# EAGLE design but8LED (EAGLE 7.2.0)
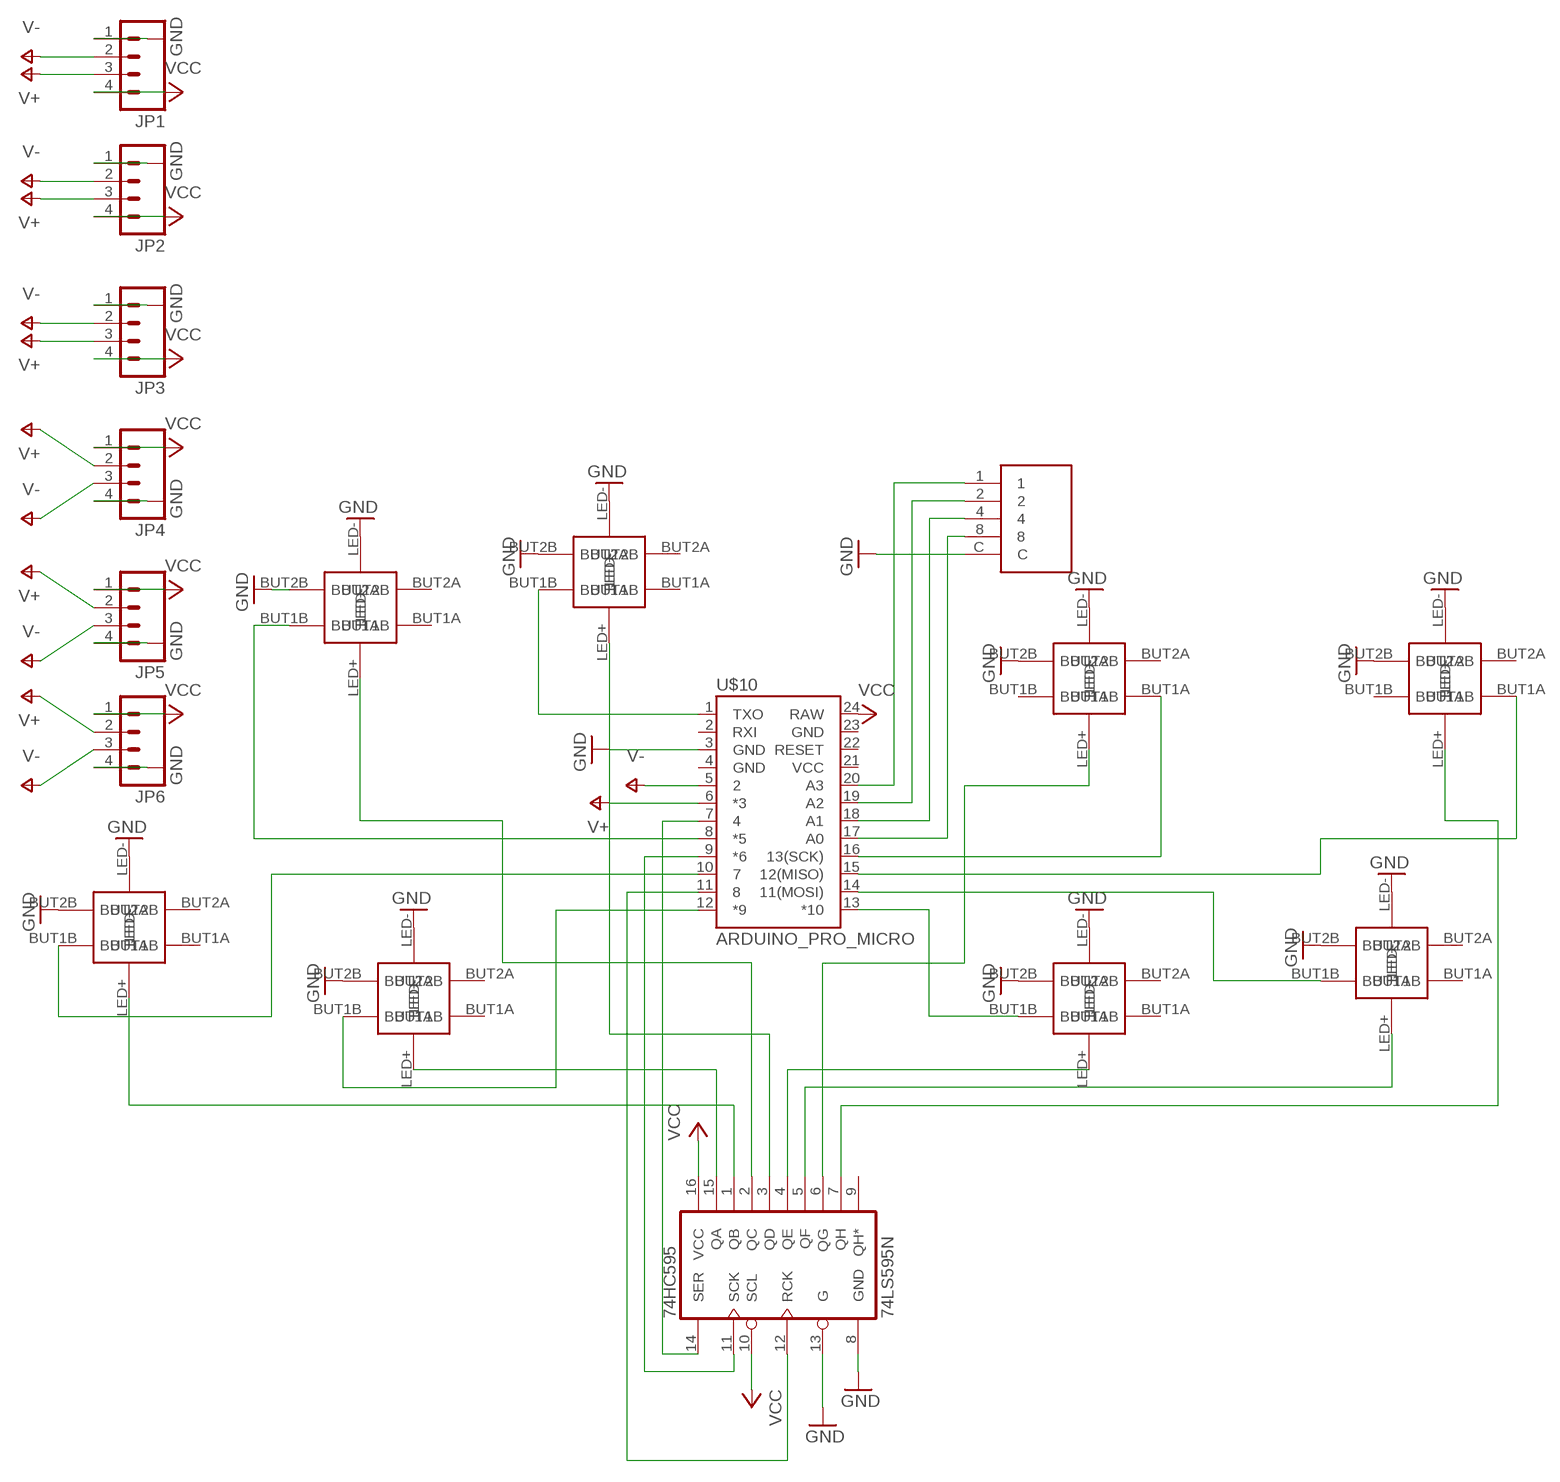
[diagram p0: schematic, sheet 1]

## Parts
74HC595  74LS595N  [DIL16]
JP1  M04PTH  [1X04]
JP2  M04PTH  [1X04]
JP3  M04PTH  [1X04]
JP4  M04PTH  [1X04]
JP5  M04PTH  [1X04]
JP6  M04PTH  [1X04]
U$1  BUTLED  [LEDBUT]
U$2  BUTLED  [LEDBUT]
U$3  BUTLED  [LEDBUT]
U$4  BUTLED  [LEDBUT]
U$5  BUTLED  [LEDBUT]
U$6  BUTLED  [LEDBUT]
U$7  BUTLED  [LEDBUT]
U$8  BUTLED  [LEDBUT]
U$9  SWITCH16POS  [SWITCH16POS]
U$10  ARDUINO_PRO_MICRO  [ARDUINO_PRO_MICRO]

## Nets
GND: 74HC595.8(GND) 74HC595.13(G) JP1.1 JP2.1 JP3.1 JP4.4 JP5.4 JP6.4 U$1.BUT2B U$1.LED- U$2.BUT2B U$2.LED- U$3.BUT2B U$3.LED- U$4.BUT2B U$4.LED- U$5.BUT2B U$5.LED- U$6.BUT2B U$6.LED- U$7.BUT2B U$7.LED- U$8.BUT2B U$8.LED- U$9.C U$10.3(GND)
N$1: U$9.1 U$10.20(A3)
N$2: U$9.2 U$10.19(A2)
N$3: U$1.BUT1B U$10.8(*5)
N$4: 74HC595.1(QB) U$6.LED+
N$5: U$6.BUT1B U$10.10
N$6: 74HC595.15(QA) U$5.LED+
N$7: 74HC595.2(QC) U$1.LED+
N$8: U$9.4 U$10.18(A1)
N$9: 74HC595.6(QG) U$3.LED+
N$10: 74HC595.7(QH) U$4.LED+
N$11: U$5.BUT1B U$10.12(*9)
N$12: U$9.8 U$10.17(A0)
N$13: 74HC595.3(QD) U$2.LED+
N$14: U$2.BUT1B U$10.1(TXO)
N$16: U$3.BUT1A U$10.16(13(SCK))
N$18: U$4.BUT1A U$10.15(12(MISO))
N$21: 74HC595.5(QF) U$8.LED+
N$22: U$8.BUT1B U$10.14(11(MOSI))
N$23: 74HC595.4(QE) U$7.LED+
N$24: U$7.BUT1B U$10.13(*10)
N$26: 74HC595.14(SER) U$10.7
N$27: 74HC595.11(SCK) U$10.9(*6)
N$28: 74HC595.12(RCK) U$10.11
V+: JP1.3 JP2.3 JP3.3 JP4.2 JP5.2 JP6.2 U$10.6(*3)
V-: JP1.2 JP2.2 JP3.2 JP4.3 JP5.3 JP6.3 U$10.5
VCC: 74HC595.10(SCL) 74HC595.16(VCC) JP1.4 JP2.4 JP3.4 JP4.1 JP5.1 JP6.1 U$10.24(RAW)
Unconnected: 74HC595.9(QH*) U$1.BUT1A U$1.BUT2A U$2.BUT1A U$2.BUT2A U$3.BUT1B U$3.BUT2A U$4.BUT1B U$4.BUT2A U$5.BUT1A U$5.BUT2A U$6.BUT1A U$6.BUT2A U$7.BUT1A U$7.BUT2A U$8.BUT1A U$8.BUT2A U$10.2(RXI) U$10.4(GND) U$10.21(VCC) U$10.22(RESET) U$10.23(GND)

## Library data of the parts
74HC595 = SparkFun-DigitalIC:74*595: 8-bit SHIFT REGISTER, output latch
JP1-JP6 = SparkFun-Connectors:M04: Header 4 Standard 4-pin 0.1" header. Use with straight break away headers (SKU : PRT-00116), right angle break away headers (PRT-00553), swiss pins (PRT-00743), machine pins (PRT-00117), and female headers (PRT-00115). Molex polarized connector foot print use with SKU : PRT-08231 with associated crimp pins and housings. 1MM SMD Version SKU: PRT-10208
U$1-U$8 = groovuino1:BUTLED
U$9 = groovuino1:SWITCH16POS
U$10 = SparkFun-Boards:ARDUINO_PRO_MICRO

## Board
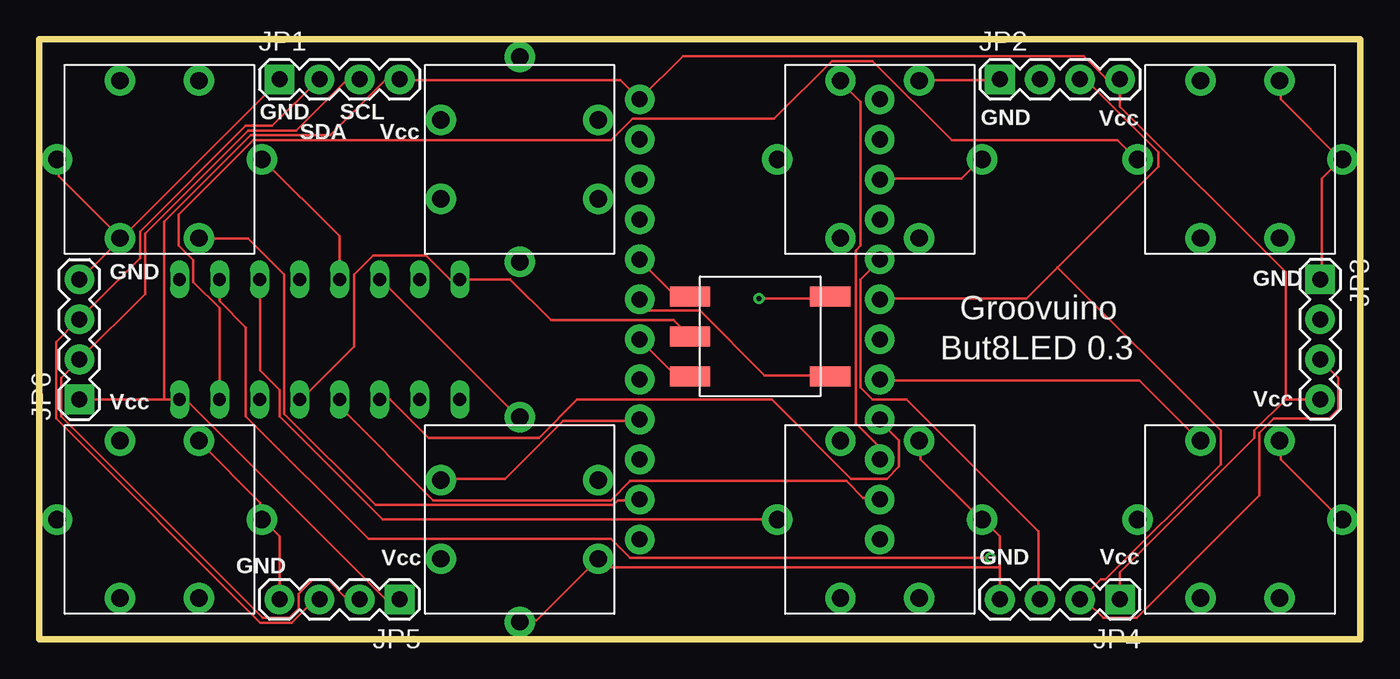
[diagram p1: board, top side]
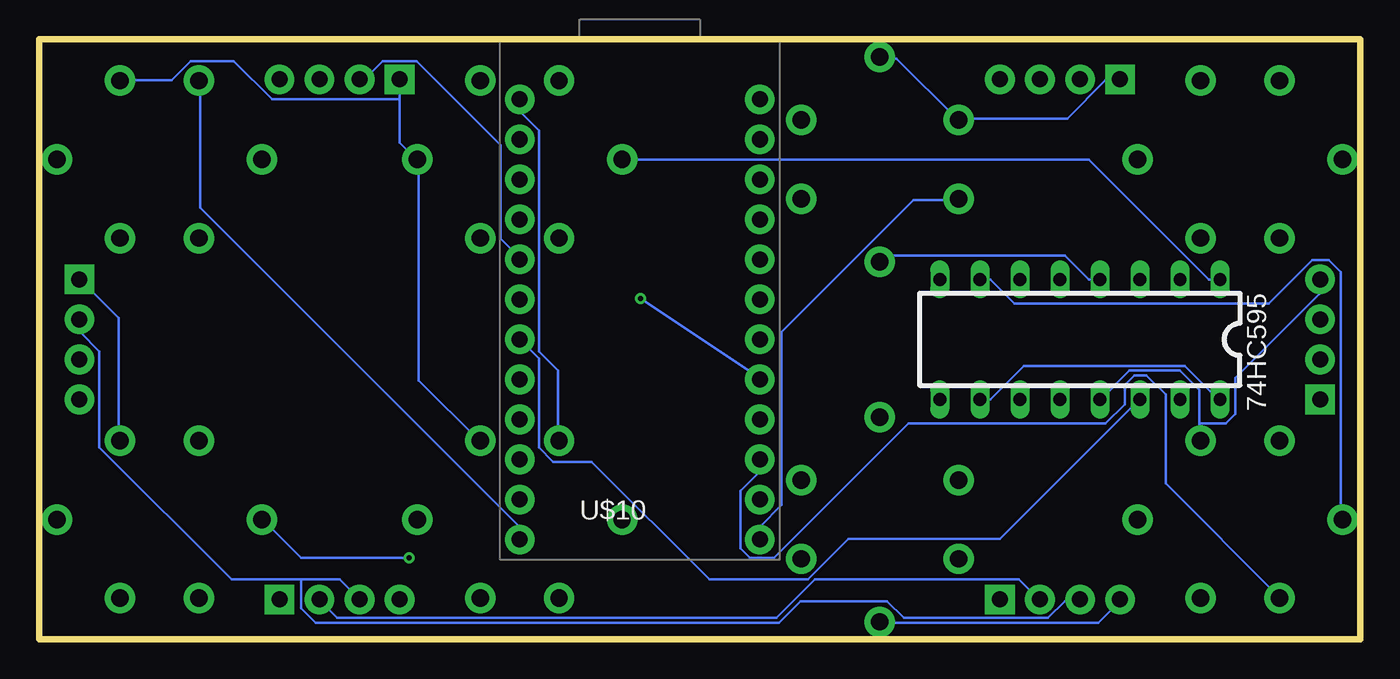
[diagram p2: board, bottom side, seen from below]

Size 83.82 x 38.1 mm. Coordinates in mm from the lower left corner, seen from the top.
Outline: 0,0 83.82,0 83.82,38.1 0,38.1 0,0
Copper layers (1*16): Top 0.0356mm / dielectric 1.5011mm / Bottom 0.0356mm
Design rules "LaenPCBOrder": minimum track width 6mil, minimum drill 13mil, track to track 6mil, track to pad 6mil, pad to pad 6mil, via to via 6mil, smd to smd 6mil, copper to edge 15mil, drill to drill 6mil, minimum pad ring 7mil, minimum via ring 7mil, stop-mask expansion 3mil, vias tented up to drill 0mil, thermal gap 10mil

### Footprints (pad centres in the part's own frame; a part is rotated, then mirrored left to right if it is on the bottom)
DIL16 = drill 0.813 long: 1 -8.89,-3.81; 2 -6.35,-3.81; 3 -3.81,-3.81; 4 -1.27,-3.81; 5 1.27,-3.81; 6 3.81,-3.81; 7 6.35,-3.81; 8 8.89,-3.81; 9 8.89,3.81; 10 6.35,3.81; 11 3.81,3.81; 12 1.27,3.81; 13 -1.27,3.81; 14 -3.81,3.81; 15 -6.35,3.81; 16 -8.89,3.81
1X04 = drill 1.016 pad 1.88 square: 1 0,0 | drill 1.016 pad 1.88: 2 2.54,0; 3 5.08,0; 4 7.62,0
LEDBUT = drill 1.1 pad 1.93: BUT1A -5,2.5; BUT1B 5,2.5; BUT2A -5,-2.5; BUT2B 5,-2.5; LED+ 0,6.5; LED- 0,-6.5
SWITCH16POS = smd 1.27 x 2.54: 1 5.08,8.89; 2 0,0; 4 0,8.89; 8 5.08,0; C 2.54,8.89
ARDUINO_PRO_MICRO = drill 1.016 pad 1.88: 1 -7.62,12.7; 2 -7.62,10.16; 3 -7.62,7.62; 4 -7.62,5.08; 5 -7.62,2.54; 6 -7.62,0; 7 -7.62,-2.54; 8 -7.62,-5.08; 9 -7.62,-7.62; 10 -7.62,-10.16; 11 -7.62,-12.7; 12 -7.62,-15.24; 13 7.62,-15.24; 14 7.62,-12.7; 15 7.62,-10.16; 16 7.62,-7.62; 17 7.62,-5.08; 18 7.62,-2.54; 19 7.62,0; 20 7.62,2.54; 21 7.62,5.08; 22 7.62,7.62; 23 7.62,10.16; 24 7.62,12.7

### Placement (x,y rotation side)
74HC595  17.78,19.05 180 bottom
JP1  15.24,35.56 0 top
JP2  60.96,35.56 0 top
JP3  81.28,22.86 270 top
JP4  68.58,2.54 180 top
JP5  22.86,2.54 180 top
JP6  2.54,15.24 90 top
U$1  76.2,7.62 90 top
U$2  53.34,7.62 90 top
U$3  30.48,7.62 0 top
U$4  7.62,7.62 90 top
U$5  76.2,30.48 90 top
U$6  53.34,30.48 90 top
U$7  30.48,30.48 180 top
U$8  7.62,30.48 270 top
U$9  50.19,16.7 90 top
U$10  45.72,21.59 0 bottom

### Tracks (layer width: path | path; a pad name or v marks a point on that pad's centre or on a via)
GND
  Top 0.152: U$1.BUT2B 78.79,12.5 78.79,11.43 82.6,7.62 U$1.LED- | 82.6,30.48 81.38,29.26 81.38,22.86 JP3.1 | 82.6,30.48 78.79,34.29 78.79,35.36 U$5.BUT2B | 82.6,30.48 U$5.LED- | JP2.1 60.96,35.51 55.93,35.51 U$6.BUT2B | U$10.3 53.34,29.26 58.52,29.26 59.74,30.48 U$6.LED- | 60.96,4.57 60.96,6.55 59.89,7.62 U$2.LED- 59.74,7.62 55.93,11.43 55.93,12.5 U$2.BUT2B | 60.96,4.57 JP4.4 | U$9.C 41.15,19.36 40.23,20.27 32.46,20.27 29.87,22.86 74HC595.8 26.06,22.86 24.54,24.38 21.18,24.38 19.96,23.17 19.96,18.59 16.61,15.24 74HC595.13 | 5.18,25.45 2.59,22.86 JP6.4 | U$8.LED- 1.22,30.48 1.22,29.41 5.03,25.6 U$8.BUT2B 5.18,25.45 | U$3.LED- 30.48,1.22 31.55,1.22 35.36,5.03 U$3.BUT2B 35.51,5.03 35.97,4.57 60.96,4.57 | JP5.4 15.24,6.55 14.17,7.62 U$4.LED- 14.02,7.62 14.02,8.69 10.21,12.5 U$4.BUT2B | 5.18,25.45 15.24,35.51 JP1.1
  Bottom 0.152: U$1.BUT2B 78.79,12.65 78.79,20.42 81.23,22.86 JP3.1 | 60.96,34.29 60.96,31.55 59.89,30.48 U$6.LED- 59.74,30.48 59.74,16.46 55.93,12.65 U$2.BUT2B | 60.96,34.29 JP2.1 | 60.96,34.29 69.04,34.29 71.48,36.73 74.22,36.73 75.44,35.51 78.64,35.51 U$5.BUT2B | JP1.1 15.24,35.51 16.15,35.51 18.59,33.07 25.45,33.07 U$7.BUT2B 25.6,33.07 29.41,36.88 30.48,36.88 U$7.LED- | 10.21,13.72 10.21,12.65 U$4.BUT2B | 10.21,13.72 10.21,15.85 11.43,17.07 14.63,17.07 16.46,15.24 74HC595.13 | U$3.LED- 30.48,1.07 16.61,1.07 15.24,2.44 JP5.4 | 10.21,13.72 8.53,13.72 7.92,14.33 7.92,16.61 2.59,21.95 2.59,22.86 JP6.4
N$1
  Top 0.152: U$9.1 41.15,21.79 40.39,21.79 38.1,24.08 U$10.20
N$2
  Top 0.152: U$9.2 50.14,16.76 46.02,16.76 41.91,20.88 38.71,20.88 38.1,21.49 U$10.19
N$3
  Top 0.152: U$10.8 53.34,16.46 69.8,16.46 73.61,12.65 U$1.BUT1B
N$4
  Bottom 0.152: 74HC595.1 9.6,22.86 17.22,30.48 U$6.LED+
N$5
  Top 0.152: U$10.10 53.34,12.19 51.82,13.72 51.82,24.69 52.12,24.99 52.12,34.14 50.9,35.36 U$6.BUT1B
N$6
  Top 0.152: 74HC595.15 11.43,21.03 9.75,22.71 9.75,24.08 8.84,24.99 8.84,26.98 13.56,31.7 36.27,31.7 37.64,33.07 46.63,33.07 50.29,36.73 52.88,36.73 57.91,31.7 68.43,31.7 69.65,30.48 U$5.LED+
N$7  (via drill 0.33)
  Top 0.152: 74HC595.2 11.43,21.49 13.11,19.81 13.11,14.17 20.88,6.4 36.27,6.4 37.49,5.18 v60.35,5.18
  Bottom 0.152: v60.35,5.18 67.21,5.18 69.65,7.62 U$1.LED+
N$8
  Top 0.152: U$10.18 40.39,16.76 41.15,16.76 U$9.4
N$9
  Top 0.152: 74HC595.6 21.64,22.86 30.48,14.02 U$3.LED+
N$10
  Bottom 0.152: 74HC595.7 23.47,22.86 21.95,21.34 5.79,21.34 3.05,24.08 1.98,24.08 1.22,23.32 1.22,7.62 U$4.LED+
N$11
  Bottom 0.152: U$10.12 53.34,7.16 73.61,27.43 73.61,35.36 U$5.BUT1B
N$12  (via drill 0.33)
  Top 0.152: v45.67,21.64 50.14,21.64 U$9.8
  Bottom 0.152: v45.67,21.64 38.1,16.61 U$10.17
N$13
  Top 0.152: U$2.LED+ 21.79,7.62 15.24,14.17 15.24,15.85 14.02,17.07 14.02,22.86 74HC595.3
N$14
  Bottom 0.152: U$10.1 53.34,33.53 52.12,32.31 52.12,18.29 50.9,17.07 50.9,12.65 U$2.BUT1B
N$16
  Top 0.152: U$10.16 38.1,13.87 33.22,13.87 29.57,10.21 25.6,10.21 U$3.BUT1A
N$18
  Bottom 0.152: U$10.15 38.1,10.67 39.32,9.45 39.32,5.79 38.71,5.18 37.19,5.18 28.65,13.72 16.15,13.72 14.94,14.94 14.94,16.15 14.33,16.76 13.56,16.76 12.34,15.54 12.34,9.91 5.18,2.74 U$4.BUT1A
N$21
  Top 0.152: 74HC595.5 19.05,25.6 14.17,30.48 U$8.LED+
N$22
  Top 0.152: U$10.14 38.1,8.84 36.73,8.84 36.42,8.53 21.34,8.53 15.54,14.33 15.54,23.17 13.26,25.45 10.21,25.45 U$8.BUT1B
N$23
  Bottom 0.152: 74HC595.4 17.22,22.86 18.75,24.38 30.18,24.38 30.48,24.08 U$7.LED+
N$24
  Bottom 0.152: U$10.13 38.1,7.16 36.73,8.53 36.73,19.51 28.35,27.89 25.6,27.89 U$7.BUT1B
N$26
  Bottom 0.152: U$10.7 52.12,17.83 52.12,12.19 51.21,11.28 48.77,11.28 41.3,3.81 35.05,3.81 32.46,6.4 22.86,6.4 14.02,15.24 74HC595.14
N$27
  Top 0.152: 74HC595.11 22.25,15.24 24.69,12.8 31.7,12.8 34.14,15.24 46.48,15.24 51.51,10.21 53.8,10.21 54.56,10.97 54.56,12.65 53.34,13.87 U$10.9
N$28
  Top 0.152: 74HC595.12 19.05,14.78 24.99,8.84 36.27,8.84 37.49,10.06 51.21,10.06 52.27,8.99 53.34,8.99 U$10.11
V+
  Top 0.152: JP5.2 20.27,2.59 19.51,2.59 18.29,3.81 17.37,3.81 16.46,2.9 16.46,1.98 15.85,1.37 14.17,1.37 1.37,14.17 1.37,16.61 JP6.2 6.71,21.95 6.71,25.76 13.26,32.31 16.31,32.31 19.51,35.51 20.27,35.51 JP1.3 | 64.62,23.62 71.02,30.02 71.02,30.94 66.45,35.51 66.14,35.51 JP2.3 | 64.62,23.62 62.64,21.64 53.34,21.64 U$10.6 | JP3.3 82.45,16.61 82.45,14.63 81.84,14.02 78.33,14.02 77.42,13.11 77.42,9.14 69.65,1.37 67.51,1.37 66.45,2.44 66.14,2.44 JP4.2 66.14,2.59 67.36,3.81 67.67,3.81 74.98,11.12 74.98,13.26 64.62,23.62
  Bottom 0.152: JP5.2 20.42,2.59 21.64,3.81 34.59,3.81 37.03,1.37 64.92,1.37 65.99,2.44 JP4.2
V-
  Top 0.152: JP5.3 17.68,2.44 17.37,2.44 16,1.07 14.02,1.07 1.07,14.02 1.07,18.9 2.44,20.27 JP6.3 2.59,20.42 6.4,24.23 6.4,25.91 13.11,32.61 14.78,32.61 17.68,35.51 JP1.2 | JP4.3 63.4,2.59 63.4,6.86 55.02,15.24 52.88,15.24 52.12,16 52.12,22.86 53.34,24.08 U$10.5
  Bottom 0.152: JP2.2 63.4,35.66 63.09,35.66 62.03,36.73 59.89,36.73 54.56,31.39 54.56,25.45 53.34,24.23 U$10.5 | 67.21,3.81 64.77,3.81 JP4.3 | 67.21,3.81 71.63,3.81 80.01,12.19 80.01,18.29 81.23,19.51 81.23,20.27 JP3.2 | 67.21,3.81 67.21,1.98 66.29,1.07 36.88,1.07 35.51,2.44 30.02,2.44 28.96,1.37 19.81,1.37 18.75,2.44 17.83,2.44 JP5.3
VCC
  Top 0.152: JP4.1 68.58,4.27 77.11,12.8 77.11,13.26 79.1,15.24 | JP3.4 79.1,15.24 | 79.1,15.24 79.1,23.32 68.58,33.83 JP2.4 68.58,35.66 67.67,35.66 66.29,37.03 40.84,37.03 U$10.24 36.88,35.51 22.86,35.51 | JP6.1 7.92,15.24 | 7.92,15.24 74HC595.16 9.3,15.24 21.95,2.59 22.86,2.59 JP5.1 | 22.86,35.51 21.95,35.51 18.44,32 13.41,32 7.92,26.52 7.92,15.24 | 22.86,35.51 JP1.4
  Bottom 0.152: 74HC595.10 23.47,15.24 21.34,17.37 11.12,17.37 8.99,15.24 74HC595.16

### Text on the board
tPlace: GND | SCL | SDA | Vcc | GND | Vcc | GND | GND | Groovuino | But8LED 0.3 | Vcc | Vcc | Vcc | GND | Vcc | GND